# EAGLE schematic ME433_Spring2017 (EAGLE 8.1.0)
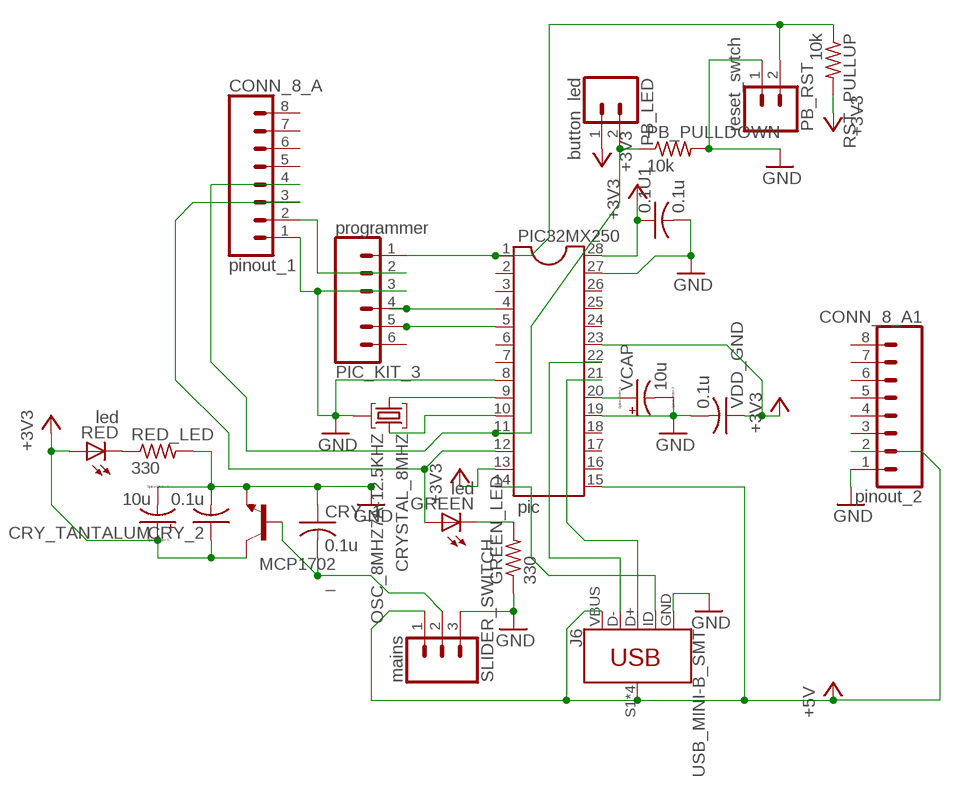
[diagram p0: schematic, sheet 1]

## Parts
0.1U1  0.1u  C-US025-025X050  [C025-025X050]
_  MCP1702  [MCP1702]
CONN_8_A  pinout_1  CONN_08"  [1X08]
CONN_8_A1  pinout_2  CONN_08"  [1X08]
CRY_1  0.1u  C-US025-025X050  [C025-025X050]
CRY_2  0.1u  C-US025-025X050  [C025-025X050]
CRY_TANTALUM  10u  CPOL-USB45181B  [B45181B]
CRYSTAL_8MHZ  OSC_8MHZ7A-12.5KHZ  [HC49U]
GREEN  led  LEDSFH482  [SFH482]
GREEN_LED  330  R-US_0204/7  [0204/7]
J6  USB_MINI-B_SMT  [USB-MINIB]
PB_LED  button_led  BUTTONS  [BUTTONS]
PB_PULLDOWN  10k  R-US_0204/7  [0204/7]
PB_RST  reset_swtch  BUTTONS  [BUTTONS]
PIC32MX250  pic  PIC-3  [PIC]
PIC_KIT_3  programmer  PICKIT3NO_SILK_FEMALE_PTH  [1X06_NO_SILK]
RED  led  LEDSFH482  [SFH482]
RED_LED  330  R-US_0204/7  [0204/7]
RST_PULLUP  10k  R-US_0204/7  [0204/7]
SLIDER_SWITCH  mains  SLIDER_SWITCH  [SLIDER_SWITCH_1MM]
VCAP  10u  CPOL-USB45181B  [B45181B]
VDD_GND  0.1u  C-US025-025X050  [C025-025X050]

## Nets
+3V3: 0.1U1.1 _.C CRY_2.1 CRY_TANTALUM.+ PB_LED.1 PIC32MX250.13 PIC32MX250.23 PIC32MX250.28 RED.A RST_PULLUP.2 VDD_GND.1
+5V: CONN_8_A1.2 J6.S1(SHIELD) J6.S2(SHIELD) J6.S3(SHIELD) J6.S4(SHIELD) J6.VBUS PIC32MX250.15 SLIDER_SWITCH.1
GND: 0.1U1.2 _.E CONN_8_A1.1 CONN_8_A.1 CRY_1.1 CRY_2.2 CRY_TANTALUM.- CRYSTAL_8MHZ.2 GREEN_LED.1 J6.GND PB_PULLDOWN.2 PB_RST.1 PIC32MX250.8 PIC32MX250.19 PIC32MX250.27 PIC_KIT_3.3 RED_LED.2 SLIDER_SWITCH.3 VCAP.- VDD_GND.2
N$1: CONN_8_A.2 PIC_KIT_3.2
N$2: PIC32MX250.4 PIC_KIT_3.4
N$3: CONN_8_A.3 GREEN.A PIC32MX250.12
N$4: J6.D- PIC32MX250.22
N$5: CRYSTAL_8MHZ.1 PIC32MX250.9
N$6: CRYSTAL_8MHZ.3 PIC32MX250.10
N$7: GREEN.K(C) GREEN_LED.2
N$8: PIC32MX250.5 PIC_KIT_3.5
N$9: J6.D+ PIC32MX250.21
N$10: CONN_8_A.4 PB_LED.2 PB_PULLDOWN.1 PIC32MX250.11
N$11: PIC32MX250.20 VCAP.+
N$14: _.B CRY_1.2 SLIDER_SWITCH.2
N$15: PB_RST.2 PIC32MX250.1 PIC_KIT_3.1 RST_PULLUP.1
N$16: RED.K(C) RED_LED.1
N$18: J6.ID PIC32MX250.14
Unconnected: CONN_8_A1.3 CONN_8_A1.4 CONN_8_A1.5 CONN_8_A1.6 CONN_8_A1.7 CONN_8_A1.8 CONN_8_A.5 CONN_8_A.6 CONN_8_A.7 CONN_8_A.8 PIC32MX250.2 PIC32MX250.3 PIC32MX250.6 PIC32MX250.7 PIC32MX250.16 PIC32MX250.17 PIC32MX250.18 PIC32MX250.24 PIC32MX250.25 PIC32MX250.26 PIC_KIT_3.6

## Library data of the parts
0.1U1 CRY_1 CRY_2 VDD_GND = ME433_Spring2017:C-US: CAPACITOR, American symbol
_ = ME433_Spring2017:MCP1702: NPN Transistor
CONN_8_A CONN_8_A1 = ME433_Spring2017:CONN_08: Multi connection point. Often used as Generic Header-pin footprint for 0.1 inch spaced/style header connections On any of the 0.1 inch spaced packages, you can populate with these: Break Away Headers - Straight <https://www.sparkfun.com/products/116> (PRT-00116) Break Away Male Headers - Right Angle <https://www.sparkfun.com/products/553> (PRT-00553) Female Headers <https://www.sparkfun.com/products/115> (PRT-00115) Break Away Headers - Machine Pin <https://www.sparkfun.com/products/117> (PRT-00117) Break Away Female Headers - Swiss Machine Pin <https://www.sparkfun.com/products/743> (PRT-00743) Arduino Stackable Header - 8 Pin <https://www.sparkfun.com/products/9279> (PRT-09279) For SCREWTERMINALS and SPRING TERMINALS visit here: Screw Terimnals on SparkFun.com <https://www.sparkfun.com/search/results?term=Screw+Terminals> (5mm/3.5mm/2.54mm spacing) This device is also useful as a general connection point to wire up your design to another part of your project. Our various solder wires solder well into these plated through hole pads. Hook-Up Wire - Assortment (Stranded, 22 AWG) <https://www.sparkfun.com/products/11375> (PRT-11375) Hook-Up Wire - Assortment (Solid Core, 22 AWG) <https://www.sparkfun.com/products/11367> (PRT-11367) View the entire wire category on our website here <https://www.sparkfun.com/categories/141> Special notes: Molex polarized connector foot print use with SKU : PRT-08231 with associated crimp pins and housings. 1MM SMD Version SKU: PRT-10208 NOTES ON THE VARIANTS LOCK and LOCK_LONGPADS... This footprint was designed to help hold the alignment of a through-hole component (i.e. 6-pin header) while soldering it into place. You may notice that each hole has been shifted either up or down by 0.005 of an inch from it's more standard position (which is a perfectly straight line). This slight alteration caused the pins (the squares in the middle) to touch the edges of the holes. Because they are alternating, it causes a "brace" to hold the component in place. 0.005 has proven to be the perfect amount of "off-center" position when using our standard breakaway headers. Although looks a little odd when you look at the bare footprint, once you have a header in there, the alteration is very hard to notice. Also,if you push a header all the way into place, it is covered up entirely on the bottom side.; PROD_ID: CONN-08438
CRY_TANTALUM VCAP = ME433_Spring2017:CPOL-US: POLARIZED CAPACITOR, American symbol
CRYSTAL_8MHZ = ME433_Spring2017:OSC_8MHZ: Monolithic Crystal Filters Source: www.golledge.com; OC_FARNELL: unknown; OC_NEWARK: unknown
GREEN RED = ME433_Spring2017:LED: LED OSRAM: - CHIPLED LG R971, LG N971, LY N971, LG Q971, LY Q971, LO R971, LY R971 LH N974, LH R974 LS Q976, LO Q976, LY Q976 LO Q996 - Hyper CHIPLED LW Q18S LB Q993, LB Q99A, LB R99A - SideLED LS A670, LO A670, LY A670, LG A670, LP A670 LB A673, LV A673, LT A673, LW A673 LH A674 LY A675 LS A676, LA A676, LO A676, LY A676, LW A676 LS A679, LY A679, LG A679 - Hyper Micro SIDELED® LS Y876, LA Y876, LO Y876, LY Y876 LT Y87S - SmartLED LW L88C, LW L88S LB L89C, LB L89S, LG L890 LS L89K, LO L89K, LY L89K LS L896, LA L896, LO L896, LY L896 - TOPLED LS T670, LO T670, LY T670, LG T670, LP T670 LSG T670, LSP T670, LSY T670, LOP T670, LYG T670 LG T671, LOG T671, LSG T671 LB T673, LV T673, LT T673, LW T673 LH T674 LS T676, LA T676, LO T676, LY T676, LB T676, LH T676, LSB T676, LW T676 LB T67C, LV T67C, LT T67C, LS T67K, LO T67K, LY T67K, LW E67C LS E67B, LA E67B, LO E67B, LY E67B, LB E67C, LV E67C, LT E67C LW T67C LS T679, LY T679, LG T679 LS T770, LO T770, LY T770, LG T770, LP T770 LB T773, LV T773, LT T773, LW T773 LH T774 LS E675, LA E675, LY E675, LS T675 LS T776, LA T776, LO T776, LY T776, LB T776 LHGB T686 LT T68C, LB T68C - Hyper Mini TOPLED® LB M676 - Mini TOPLED Santana® LG M470 LS M47K, LO M47K, LY M47K Source: http://www.osram.convergy.de LUXEON: - LUMILED® LXK2-PW12-R00, LXK2-PW12-S00, LXK2-PW14-U00, LXK2-PW14-V00 LXK2-PM12-R00, LXK2-PM12-S00, LXK2-PM14-U00 LXK2-PE12-Q00, LXK2-PE12-R00, LXK2-PE12-S00, LXK2-PE14-T00, LXK2-PE14-U00 LXK2-PB12-K00, LXK2-PB12-L00, LXK2-PB12-M00, LXK2-PB14-N00, LXK2-PB14-P00, LXK2-PB14-Q00 LXK2-PR12-L00, LXK2-PR12-M00, LXK2-PR14-Q00, LXK2-PR14-R00 LXK2-PD12-Q00, LXK2-PD12-R00, LXK2-PD12-S00 LXK2-PH12-R00, LXK2-PH12-S00 LXK2-PL12-P00, LXK2-PL12-Q00, LXK2-PL12-R00 Source: www.luxeon.com KINGBRIGHT: KA-3528ASYC Source: www.kingbright.com
GREEN_LED PB_PULLDOWN RED_LED RST_PULLUP = ME433_Spring2017:R-US_: RESISTOR, American symbol
J6 = ME433_Spring2017:USB_MINI-B: USB type Mini-B Connector Breaks out 5th pin, and includes shield pins if needed. SparkFun Products: SparkFun FTDI Basic Breakout <https://www.sparkfun.com/products/9716> SparkFun XBee Explorer USB <https://www.sparkfun.com/products/11812> SparkFun Redboard <https://www.sparkfun.com/products/12757>; PROD_ID: CONN-08193; SF_ID: PRT-00587
PB_LED PB_RST = ME433_Spring2017:BUTTONS: Multi connection point. Often used as Generic Header-pin footprint for 0.1 inch spaced/style header connections On any of the 0.1 inch spaced packages, you can populate with these: Break Away Headers - Straight <https://www.sparkfun.com/products/116> (PRT-00116) Break Away Male Headers - Right Angle <https://www.sparkfun.com/products/553> (PRT-00553) Female Headers <https://www.sparkfun.com/products/115> (PRT-00115) Break Away Headers - Machine Pin <https://www.sparkfun.com/products/117> (PRT-00117) Break Away Female Headers - Swiss Machine Pin <https://www.sparkfun.com/products/743> (PRT-00743) For SCREWTERMINALS and SPRING TERMINALS visit here: Screw Terimnals on SparkFun.com <https://www.sparkfun.com/search/results?term=Screw+Terminals> (5mm/3.5mm/2.54mm spacing) This device is also useful as a general connection point to wire up your design to another part of your project. Our various solder wires solder well into these plated through hole pads. Hook-Up Wire - Assortment (Stranded, 22 AWG) <https://www.sparkfun.com/products/11375> (PRT-11375) Hook-Up Wire - Assortment (Solid Core, 22 AWG) <https://www.sparkfun.com/products/11367> (PRT-11367) View the entire wire category on our website here <https://www.sparkfun.com/categories/141> Special notes: Molex polarized connector foot print use with: PRT-08233 with associated crimp pins and housings. 2.54_SCREWTERM for use with PRT-10571. 3.5mm Screw Terminal footprints for PRT-08084 5mm Screw Terminal footprints for use with PRT-08432
PIC32MX250 = ME433_Spring2017:PIC: Dual In Line
PIC_KIT_3 = ME433_Spring2017:PICKIT3: Multi connection point. Often used as Generic Header-pin footprint for 0.1 inch spaced/style header connections On any of the 0.1 inch spaced packages, you can populate with these: Break Away Headers - Straight <https://www.sparkfun.com/products/116> (PRT-00116) Break Away Male Headers - Right Angle <https://www.sparkfun.com/products/553> (PRT-00553) Female Headers <https://www.sparkfun.com/products/115> (PRT-00115) Break Away Headers - Machine Pin <https://www.sparkfun.com/products/117> (PRT-00117) Break Away Female Headers - Swiss Machine Pin <https://www.sparkfun.com/products/743> (PRT-00743) Arduino Stackable Header - 6 Pin <https://www.sparkfun.com/products/9280> (PRT-09280) For SCREWTERMINALS and SPRING TERMINALS visit here: Screw Terimnals on SparkFun.com <https://www.sparkfun.com/search/results?term=Screw+Terminals> (5mm/3.5mm/2.54mm spacing) This device is also useful as a general connection point to wire up your design to another part of your project. Our various solder wires solder well into these plated through hole pads. Hook-Up Wire - Assortment (Stranded, 22 AWG) <https://www.sparkfun.com/products/11375> (PRT-11375) Hook-Up Wire - Assortment (Solid Core, 22 AWG) <https://www.sparkfun.com/products/11367> (PRT-11367) View the entire wire category on our website here <https://www.sparkfun.com/categories/141>; PROD_ID: CONN-08437
SLIDER_SWITCH = ME433_Spring2017:SLIDER_SWITCH: Multi connection point. Often used as Generic Header-pin footprint for 0.1 inch spaced/style header connections On any of the 0.1 inch spaced packages, you can populate with these: Break Away Headers - Straight <https://www.sparkfun.com/products/116> (PRT-00116) Break Away Male Headers - Right Angle <https://www.sparkfun.com/products/553> (PRT-00553) Female Headers <https://www.sparkfun.com/products/115> (PRT-00115) Break Away Headers - Machine Pin <https://www.sparkfun.com/products/117> (PRT-00117) Break Away Female Headers - Swiss Machine Pin <https://www.sparkfun.com/products/743> (PRT-00743) Stackable Header - 3 Pin (Female, 0.1") <https://www.sparkfun.com/products/13875> (PRT-13875) For SCREWTERMINALS and SPRING TERMINALS visit here: Screw Terimnals on SparkFun.com <https://www.sparkfun.com/search/results?term=Screw+Terminals> (5mm/3.5mm/2.54mm spacing) This device is also useful as a general connection point to wire up your design to another part of your project. Our various solder wires solder well into these plated through hole pads. Hook-Up Wire - Assortment (Stranded, 22 AWG) <https://www.sparkfun.com/products/11375> (PRT-11375) Hook-Up Wire - Assortment (Solid Core, 22 AWG) <https://www.sparkfun.com/products/11367> (PRT-11367) View the entire wire category on our website here <https://www.sparkfun.com/categories/141> Special notes: Molex polarized connector foot print use with SKU : PRT-08232 with associated crimp pins and housings.